# Altium schematic sheet Mathematical Function.schdoc: Mathematical Function
size A4; Organization: Altium Limited; Address1: L3, 12a Rodborough Rd; Address2: Frenchs Forest; Address3: NSW; Address4: Australia 2086; DocumentNumber: 1; SheetNumber: 1; SheetTotal: 1
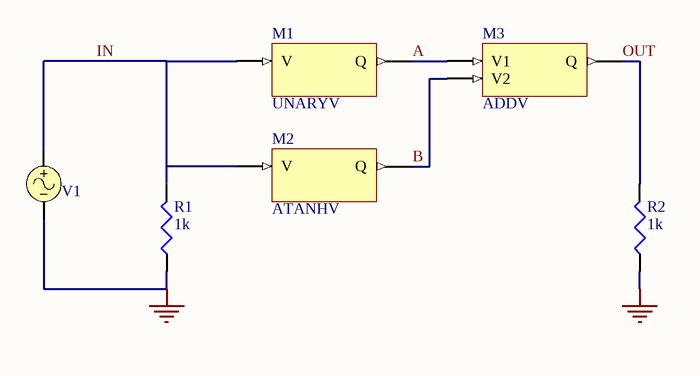
[diagram p0: Mathematical Function.schdoc]

## Parts
M1  UNARYV
M2  ATANHV
M3  ADDV
R1  1k
R2  1k
V1  VSIN  (value not drawn)

## Nets
GND: R1.2(BOT) R2.2(BOT) V1.2
A: M1.2(Q) M3.1(V1)
B: M2.2(Q) M3.2(V2)
IN: M1.1(V) M2.1(V) R1.1(TOP) V1.1
OUT: M3.3(Q) R2.1(TOP)

## Notes on the sheet
- Title
- Size:
- Date:
- A4
- Number:
- Time:
- Revision:
- Sheet
- of
- File:

## Library data of the parts
M1 = UNARYV: Unary - of Voltage
M2 = ATANHV: Hyperbolic Arc Tangent of Voltage
M3 = ADDV: Add Voltages
R1 R2 = RES: Resistor; Value: 1k
V1 = VSIN: Sinusoidal Voltage Source